# EAGLE design Numberwang_no_artwork (EAGLE 9.4.2)
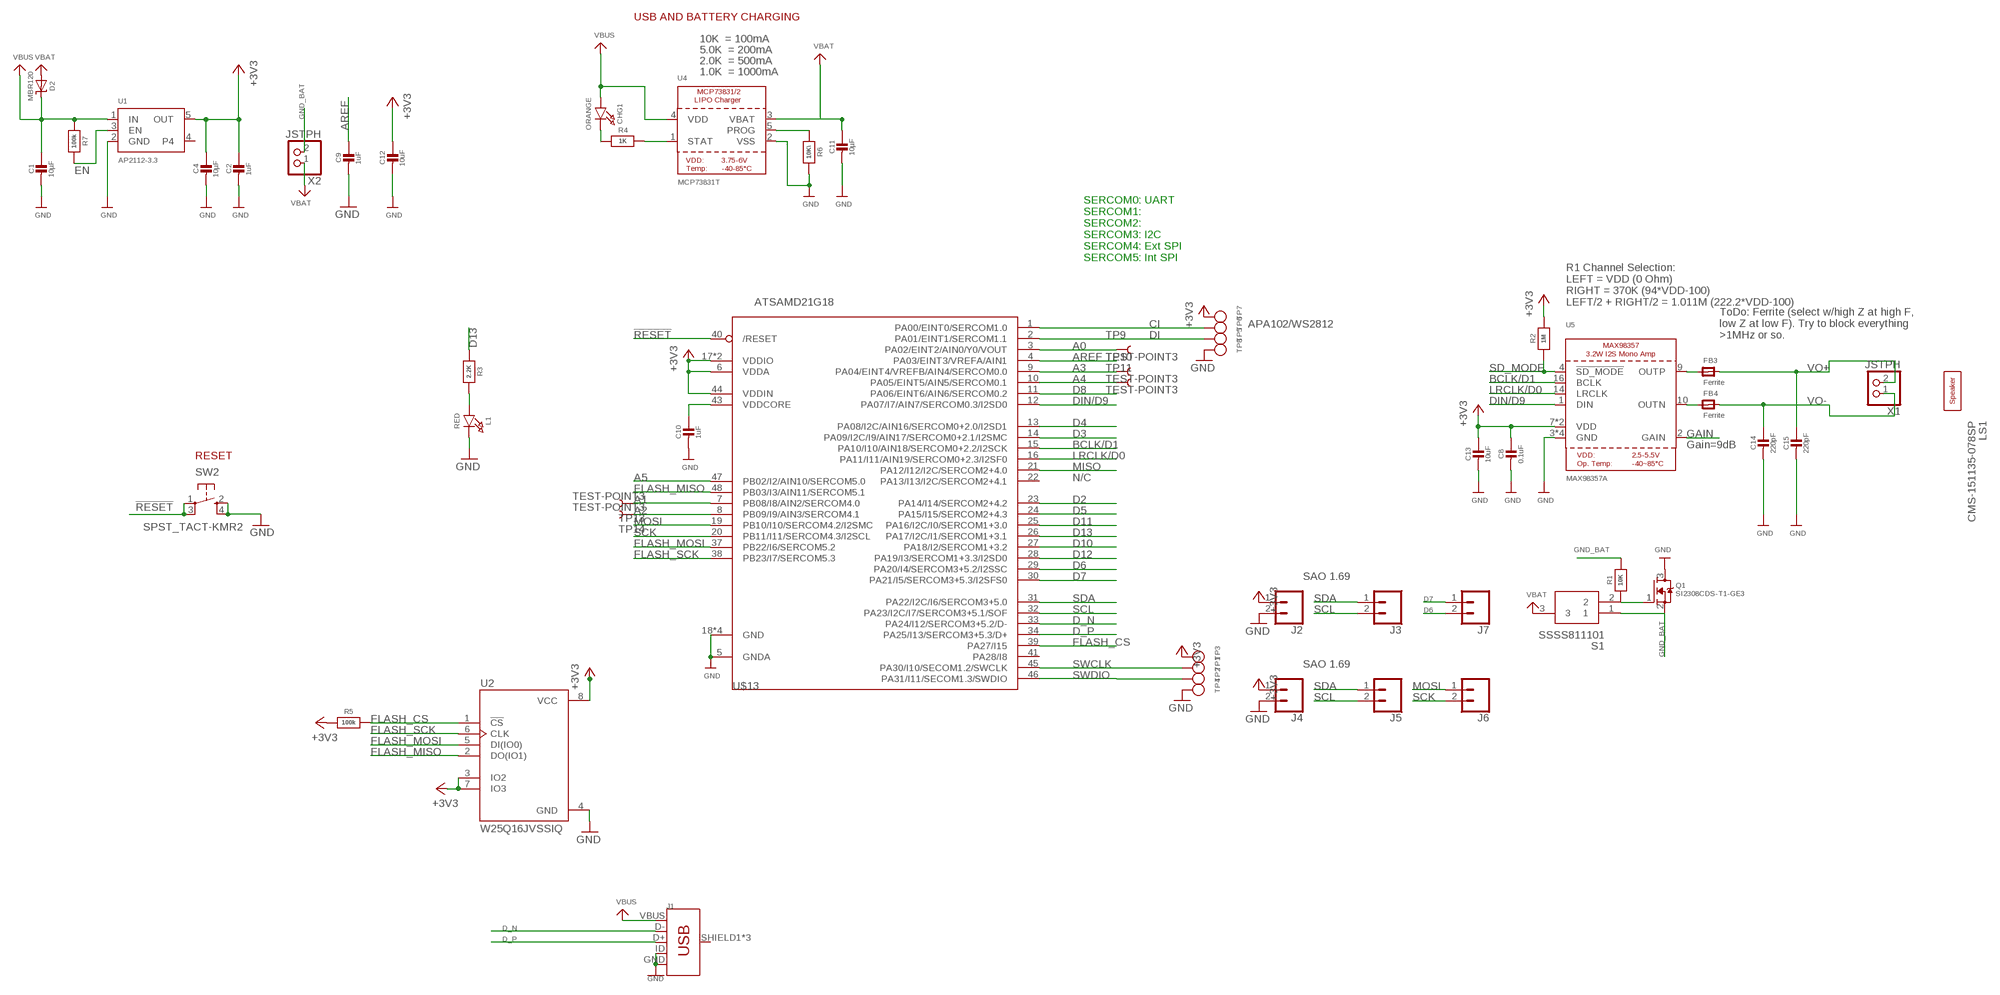
[diagram p0: schematic, sheet 1]

## Parts
C1  10µF  CAP_CERAMIC_0805MP  [_0805MP]
C2  1uF  CAP_CERAMIC_0603MP  [_0603MP]
C4  10µF  CAP_CERAMIC_0805MP  [_0805MP]
C8  0.1uF  CAP_CERAMIC_0805MP  [_0805MP]
C9  1uF  CAP_CERAMIC_0603MP  [_0603MP]
C10  1uF  CAP_CERAMIC_0603MP  [_0603MP]
C11  10µF  CAP_CERAMIC_0805MP  [_0805MP]
C12  10uF  CAP_CERAMIC_0805MP  [_0805MP]
C13  10uF  CAP_CERAMIC_0805MP  [_0805MP]
C14  220pF  CAP_CERAMIC_0805MP  [_0805MP]
C15  220pF  CAP_CERAMIC_0805MP  [_0805MP]
CHG1  ORANGE  LED0805_NOOUTLINE  [CHIPLED_0805_NOOUTLINE]
D2  MBR120  DIODE-SCHOTTKYSOD-123  [SOD-123]
FB3  Ferrite  FERRITE  [0603]
FB4  Ferrite  FERRITE  [0603]
J1  USB_MICRO-B_FEMALE-SMT  [USB-B-MICRO-SMD]
J2  CONN_02  [1X02]
J3  CONN_02  [1X02]
J4  CONN_02  [1X02]
J5  CONN_02  [1X02]
J6  CONN_02  [1X02]
J7  CONN_02  [1X02]
L1  RED  LED0805_NOOUTLINE  [CHIPLED_0805_NOOUTLINE]
LS1  CMS-151135-078SP  [CMS151135078SP]
Q1  SI2308CDS-T1-GE3  MOSFET-NWIDE  [SOT23-WIDE]
R1  10K  RESISTOR_0805MP  [_0805MP]
R2  1M  RESISTOR_0805MP  [_0805MP]
R3  2.2K  RESISTOR_0603MP  [_0603MP]
R4  1K  RESISTOR_0603MP  [_0603MP]
R5  100k  RESISTOR_0603MP  [_0603MP]
R6  10K\  RESISTOR_0603MP  [_0603MP]
R7  100k  RESISTOR_0603MP  [_0603MP]
S1  SSSS811101  [SSSS811101]
SW2  SPST_TACT-KMR2  [KMR2]
TP1  TESTPOINTROUND2MM  [TESTPOINT_ROUND_2MM]
TP2  TESTPOINTROUND2MM  [TESTPOINT_ROUND_2MM]
TP3  TESTPOINTROUND2MM  [TESTPOINT_ROUND_2MM]
TP4  TESTPOINTROUND2MM  [TESTPOINT_ROUND_2MM]
TP5  TESTPOINTROUND2MM  [TESTPOINT_ROUND_2MM]
TP6  TESTPOINTROUND2MM  [TESTPOINT_ROUND_2MM]
TP7  TESTPOINTROUND2MM  [TESTPOINT_ROUND_2MM]
TP8  TESTPOINTROUND2MM  [TESTPOINT_ROUND_2MM]
TP9  TEST-POINT3  [PAD.03X.03]
TP10  TEST-POINT3  [PAD.03X.03]
TP11  TEST-POINT3  [PAD.03X.03]
TP13  TEST-POINT3  [PAD.03X.03]
TP14  TEST-POINT3  [PAD.03X.03]
U1  AP2112-3.3  VREG_SOT23-5  [SOT23-5]
U2  W25Q16JVSSIQ  [SOIC127P790X216-8N]
U4  MCP73831T  MCP73831/2  [SOT23-5@1]
U5  MAX98357A  AUDIOAMP_MAX98357  [QFN16_3MM]
U$13  ATSAMD21G18  ATSAMD21G_QFN  [TQFN48_7MM]
X1  JSTPH  CON_JST_PH_2PIN  [JSTPH2]
X2  JSTPH  CON_JST_PH_2PIN  [JSTPH2]

## Nets
!RESET: SW2.1(P) SW2.3(P1) U$13.40(/RESET)
+3V3: C2.1 C4.1 C8.1 C12.1 C13.1 J2.1 J4.1 R2.2 R5.1 TP3.P$1 TP7.P$1 U1.5(OUT) U2.3(IO2) U2.7(IO3) U2.8(VCC) U5.7(VDD) U5.8(VDD) U$13.6(VDDA) U$13.17(VDDIO) U$13.36(VDDIO) U$13.44(VDDIN)
A0: TP9.P$1 U$13.3(PA02/EINT2/AIN0/Y0/VOUT)
A1: TP13.P$1 U$13.7(PB08/I8/AIN2/SERCOM4.0)
A2: TP14.P$1 U$13.8(PB09/I9/AIN3/SERCOM4.1)
A3: TP10.P$1 U$13.9(PA04/EINT4/VREFB/AIN4/SERCOM0.0)
A4: TP11.P$1 U$13.10(PA05/EINT5/AIN5/SERCOM0.1)
A5: U$13.47(PB02/I2/AIN10/SERCOM5.0)
AREF: C9.1 U$13.4(PA03/EINT3/VREFA/AIN1)
BCLK/D1: U5.16(BCLK) U$13.15(PA10/I10/AIN18/SERCOM0+2.2/I2SCK)
CI: TP6.P$1 U$13.1(PA00/EINT0/SERCOM1.0)
D2: U$13.23(PA14/I14/SERCOM2+4.2)
D3: U$13.14(PA09/I2C/I9/AIN17/SERCOM0+2.1/I2SMC)
D4: U$13.13(PA08/I2C/AIN16/SERCOM0+2.0/I2SD1)
D5: U$13.24(PA15/I15/SERCOM2+4.3)
D6: J7.2 U$13.29(PA20/I4/SERCOM3+5.2/I2SSC)
D7: J7.1 U$13.30(PA21/I5/SERCOM3+5.3/I2SFS0)
D8: U$13.11(PA06/EINT6/AIN6/SERCOM0.2)
D10: U$13.27(PA18/I2/SERCOM1+3.2)
D11: U$13.25(PA16/I2C/I0/SERCOM1+3.0)
D12: U$13.28(PA19/I3/SERCOM1+3.3/I2SD0)
D13: R3.1 U$13.26(PA17/I2C/I1/SERCOM1+3.1)
D_N: J1.D- U$13.33(PA24/I12/SERCOM3+5.2/D-)
D_P: J1.D+ U$13.34(PA25/I13/SERCOM3+5.3/D+)
DI: TP5.P$1 U$13.2(PA01/EINT1/SERCOM1.1)
DIN/D9: U5.1(DIN) U$13.12(PA07/I7/AIN7/SERCOM0.3/I2SD0)
EN: R7.2 U1.3(EN)
FLASH_CS: R5.2 U2.1(!CS) U$13.39(PA27/I15)
FLASH_MISO: U2.2(DO(IO1)) U$13.48(PB03/I3/AIN11/SERCOM5.1)
FLASH_MOSI: U2.5(DI(IO0)) U$13.37(PB22/I6/SERCOM5.2)
FLASH_SCK: U2.6(CLK) U$13.38(PB23/I7/SERCOM5.3)
GAIN: U5.2(GAIN)
GND: C1.2 C2.2 C4.2 C8.2 C9.2 C10.2 C11.2 C12.2 C13.2 C14.2 C15.2 J1.GND J1.ID J2.2 J4.2 L1.C Q1.3(D) R6.2 SW2.2(S) SW2.4(S1) TP4.P$1 TP8.P$1 U1.2(GND) U2.4(GND) U4.2(VSS) U5.3(GND) U5.11(GND) U5.15(GND) U5.THERMAL(GND) U$13.5(GNDA) U$13.18(GND) U$13.35(GND) U$13.42(GND) U$13.THERMAL(GND)
GND_BAT: Q1.2(S) R1.2 S1.1 X2.2
LRCLK/D0: U5.14(LRCLK) U$13.16(PA11/I11/AIN19/SERCOM0+2.3/I2SF0)
MISO: U$13.21(PA12/I12/I2C/SERCOM2+4.0)
MOSI: J6.1 U$13.19(PB10/I10/SERCOM4.2/I2SMC)
N$2: FB4.1 U5.10(OUTN)
N$3: L1.A R3.2
N$4: FB3.1 U5.9(OUTP)
N$5: Q1.1(G) R1.1 S1.2
N$8: CHG1.C R4.1
N$9: R4.2 U4.1(STAT)
N$10: R6.1 U4.5(PROG)
SCK: J6.2 U$13.20(PB11/I11/SERCOM4.3/I2SCL)
SCL: J3.2 J5.2 U$13.32(PA23/I2C/I7/SERCOM3+5.1/SOF)
SD_MODE: R2.1 U5.4(!SD_MODE)
SDA: J3.1 J5.1 U$13.31(PA22/I2C/I6/SERCOM3+5.0)
SWCLK: TP1.P$1 U$13.45(PA30/I10/SECOM1.2/SWCLK)
SWDIO: TP2.P$1 U$13.46(PA31/I11/SECOM1.3/SWDIO)
VBAT: C11.1 D2.A S1.3 U4.3(VBAT) X2.1
VBUS: C1.1 CHG1.A D2.C J1.VBUS R7.1 U1.1(IN) U4.4(VDD)
VDDCORE1: C10.1 U$13.43(VDDCORE)
VO+: C15.1 FB3.2 X1.2
VO-: C14.1 FB4.2 X1.1
Unconnected: J1.SHIELD1(SHIELD) J1.SHIELD2(SHIELD) J1.SHIELD3(SHIELD) U1.4 U$13.22(PA13/I13/I2C/SERCOM2+4.1) U$13.41(PA28/I8)

## Notes on the sheet
- USB AND BATTERY CHARGING
- 10K  = 100mA
- 5.0K  = 200mA
- 2.0K  = 500mA
- 1.0K  = 1000mA
- SERCOM0: UART
  SERCOM1:
  SERCOM2:
  SERCOM3: I2C
  SERCOM4: Ext SPI
  SERCOM5: Int SPI
- R1 Channel Selection:
  LEFT = VDD (0 Ohm)
  RIGHT = 370K (94*VDD-100)
  LEFT/2 + RIGHT/2 = 1.011M (222.2*VDD-100)
- APA102/WS2812
- ToDo: Ferrite (select w/high Z at high F,
  low Z at low F). Try to block everything
  >1MHz or so.
- Gain=9dB
- RESET
- N/C
- SAO 1.69
- SAO 1.69

## Library data of the parts
C1 C2 C4 C8-C15 = microbuilder:CAP_CERAMIC: Ceramic Capacitors 0402 - 0402 Surface Mount Capacitors 16pF 50V 5% [Digikey: 445-4899-2-ND] 18pF 50V 5% [Digikey: 490-1281-2-ND] 22pF 50V 5% [Digikey: 490-1283-2-ND] 68pF 50V 5% [Digikey: 490-1289-2-ND] 0.1uF 10V 10% [Digikey: 490-1318-2-ND] 1.0uF 6.3V 10% [Digikey: 490-1320-2-ND] 0603 - 0603 Surface Mount Capacitors 16 pF 50V 5% [Digikey: 445-5051-2-ND] 22 pF 50V [Digikey: PCC220ACVTR-ND] 33 pF 50V 5% [Digikey: 490-1415-1-ND] 56pF 50V 5% [Digikey: 490-1421-1-ND] 220pF 50V 5% [Digikey: 445-1285-1-ND] 680 pF 50V 2200 pF 50V 5% C0G [Digikey: 445-1297-1-ND] 5600 pF 100V 5% X7R [Digikey: 478-3711-1-ND] 0.1 µF 25V 10% [Digikey: PCC2277TR-ND] 0.22 µF 16V 10% X7R [Digikey: 445-1318-1-ND] 1.0 µF 25V 10% [Digikey: 445-5146-2-ND] 0603 - RF Specific 3pF 250V +/-0.1pF RF [Digikey: 712-1347-1-ND] 18 pF 250V 5% [Digikey: 478-3505-1-ND or 712-1322-1-ND] 56 pF 250V 5% C0G RF [Digikey: 490-4867-1-ND] 68 pF 250V RF [Digikey: 490-4868-1-ND] 0805 - 0805 Surface Mount Capacitors 220 pF 250V 2% RF Ceramic Capacitor [Digikey: 712-1398-1-ND] 1000 pF 50V 2% NP0 Ceramic Capacitor [Digikey: 478-3760-1-ND] 0.1 µF 25V 10% Ceramic Capacitor [Digikey: PCC1828TR-ND] 1.0 µF 16V 10% Ceramic Capacitor[Digikey: 490-1691-2-ND] 10.0 µF 10V 10% Ceramic Capacitor[Digikey: 709-1228-1-ND] 10.0 uF 16V 10% Ceramic Capacitor [Digikey: 478-5165-2-ND] 47 uF 6.3V 20% Ceramic Capacitor [Digikey: 587-1779-1-ND or 399-5506-1-ND] 1206 - 1206 Surface Mount Capacitors 47uF 10V 20% Ceramic Capacitor [Digikey: 490-5528-1-ND or 399-5508-1-ND or 445-6010-1-ND] 100uF 6.3V -20%, +80% Y5V Ceramic Capacitor (Digikey: 490-4512-1-ND, Mouser: 81-GRM31CF50J107ZE1L)
CHG1 L1 = microbuilder:LED: LED 0603 - 0603 Surface Mount Package 2mA: Green LED - Low Power (3.9mcd, 2ma, 1.7Vf) - Digikey: 475-2709-2-ND Orange LED - Low Power (9.8mcd, 2ma, 1.8Vf) - Digikey: 475-1194-2-ND Red LED - Low Power (5mcd, 2ma, 1.8Vf) - Digikey: 475-1195-2-ND Yellow LED - Low Power (7mcd, 2ma, 1.8Vf) - Digikey: 475-1196-2-ND 5mA: Blue LED - Low Power (17mcd, 5ma, 2.9Vf) - Digikey: LNJ937W8CRACT-ND 0805 - 0805 Surface Mount Package 2mA: Red LED (8.8mcd, 2mA, 1.8Vf, Clear) - Low Power [Digikey: 475-2510-1-ND] Green LED (5mcd, 2mA, 1.8Vf, Clear) - Low Power [Digikey: 475-2730-1-ND] Yellow LED (11.3mcd, 2mA, 1.8Vf, Clear) - Low Power [Digikey: 475-2555-1-ND] 20mA: Red LED (104mcd, 20mA, Diffused) - LS R976 [Digikey: 475-1278-6-ND] Red LED (12mcd, 20mA, 2.0Vf, Clear) - APT2012EC [Digikey: 754-1128-1-ND] Green LED (15mcd, 20mA, 2.2Vf, Clear) - APT2012GC [Digikey: 754-1131-1-ND] Orange LED (160mcd, 20mA, 2.1Vf, Clear) - APT2012SECK [Digikey: 754-1130-1-ND] 1206 - 1206 Surface Mount Package Green LED (26mcd, 20mA, Diffused) - LG N971 [Digikey: 475-1407-6-ND] Red LED (15mcd, 20mA, Diffused) - LH N974 [Digikey: 475-1416-6-ND]
D2 = microbuilder:DIODE-SCHOTTKY
FB3 FB4 = microbuilder:FERRITE: Ferrite Bead 0603 MMZ1608B121C - 120 Ohm @ 100MHz, 600mA, 0.15 Ohm DC Resistance - Digikey: 445-2164-1-ND BK1608HW121-T - 120 Ohm, 600mA Ferrite Chip - Digikey: 587-1876-2-ND 0805 HZ0805B272R-10 - 2.7K Ohm @ 100MHz, 200mA, 0.8 Ohm DC Resistance - Digikey: 240-2504-1-ND (see also Murata BLM21BD272SN1L) MMZ2012Y152B - 1.5K Ohm @ 100MHz, 500mA, 0.4 Ohm DC Resistance - Digikey: 445-1560-1-ND - Mainly for high frequency (80-400MHz) MMZ2012R102A - 1K Ohm @ 100MHz, 500mA, 0.3 Ohm DC Resistance - Digikey: 445-1555-2-ND - More general purpose (10-200MHz)
J1 = SparkFun-Connectors:USB_MICRO-B: USB Type Micro-B Connector Male/female and PTH/SMT variants SparkFun Products: SparkFun microB USB Breakout <https://www.sparkfun.com/products/12035> SparkFun USB microB Plug Breakout <https://www.sparkfun.com/products/10031> SparkFun ESP8266 Thing <https://www.sparkfun.com/products/13231>; PROD_ID: CONN-11752
J2-J7 = SparkFun-Connectors:CONN_02: Multi connection point. Often used as Generic Header-pin footprint for 0.1 inch spaced/style header connections On any of the 0.1 inch spaced packages, you can populate with these: Break Away Headers - Straight <https://www.sparkfun.com/products/116> (PRT-00116) Break Away Male Headers - Right Angle <https://www.sparkfun.com/products/553> (PRT-00553) Female Headers <https://www.sparkfun.com/products/115> (PRT-00115) Break Away Headers - Machine Pin <https://www.sparkfun.com/products/117> (PRT-00117) Break Away Female Headers - Swiss Machine Pin <https://www.sparkfun.com/products/743> (PRT-00743) For SCREWTERMINALS and SPRING TERMINALS visit here: Screw Terimnals on SparkFun.com <https://www.sparkfun.com/search/results?term=Screw+Terminals> (5mm/3.5mm/2.54mm spacing) This device is also useful as a general connection point to wire up your design to another part of your project. Our various solder wires solder well into these plated through hole pads. Hook-Up Wire - Assortment (Stranded, 22 AWG) <https://www.sparkfun.com/products/11375> (PRT-11375) Hook-Up Wire - Assortment (Solid Core, 22 AWG) <https://www.sparkfun.com/products/11367> (PRT-11367) View the entire wire category on our website here <https://www.sparkfun.com/categories/141> Special notes: Molex polarized connector foot print use with: PRT-08233 with associated crimp pins and housings. 2.54_SCREWTERM for use with PRT-10571. 3.5mm Screw Terminal footprints for PRT-08084 5mm Screw Terminal footprints for use with PRT-08432
LS1 = SamacSys_Parts:CMS-151135-078SP: Speakers & Transducers 0.7W 8ohm 550Hz 15x11mm Solder Pads Source: Datasheet <https://componentsearchengine.com/Datasheets/1/CMS-151135-078SP.pdf>; DESCRIPTION: Speakers & Transducers 0.7W 8ohm 550Hz 15x11mm Solder Pads; HEIGHT: 3.7mm; MANUFACTURER_NAME: CUI; MANUFACTURER_PART_NUMBER: CMS-151135-078SP; MOUSER_PART_NUMBER: 490-CMS-151135-078SP; MOUSER_PRICE-STOCK: https://www.mouser.com/Search/Refine.aspx?Keyword=490-CMS-151135-078SP
Q1 = microbuilder:MOSFET-N: N-Channel Mosfet LEGEND VDS: Voltage Drain-Source ID: Drain Current RDS(ON): Drain-Source On-State Resistance VGS(TH): Gate-Source Threshold Voltage CISS: Drain-Source Input Capacitance SOT-23 Name VDS ID RDS(ON) VGS(TH) CISS Order Number 2N7002E 60V 260mA 2.5 Ohm 2.5V @ 250uA 26.7pF @ 25V 2N7002ET1GOSTR-ND BSH103 30V 850mA 400 mOhm 400mV @ 1mA 83pF @ 24V BSH103,235-ND BSS138 60V 320mA 1.6 Ohm 1.5V @ 250uA 50pF @ 10V Mouser: 771-BSS138PW115 DMN2075U-7 20V 4.2A 38 mOhm 1V @ 250 uA 594.3pF @ 10V DMN2075U-7DICT-ND * BSS138 good choice for I2C level-shifting
R1-R7 = microbuilder:RESISTOR: Resistors 0402 - 0402 Surface Mount Package 22 Ohm 1% 1/16W [Digikey: 311-22.0LRTR-ND] 33 Ohm 5% 1/16W 1.0K 5% 1/16W 1.5K 5% 1/16W 2.0K 1% 1/16W 10.0K 1% 1/16W [Digikey: 311-10.0KLRTR-ND] 10.0K 5% 1/16W [Digikey: RMCF0402JT10K0TR-ND] 12.1K 1% 1/16W [Digikey: 311-22.0LRTR-ND] 100.0K 5% 1/16W 0603 - 0603 Surface Mount Package 0 Ohm 1/10 Watt 1% Resistor 15 Ohm 1/10 Watt 1% Resistor 33 Ohm 1/10 Watt 1% Resistor 49.9 Ohm 1/10 Watt 1% Resistor 100 Ohm 1/10 Watt 1% Resistor 150 Ohm 1/10 Watt 1% Resistor 240 Ohm 1/10 Watt 1% Resistor 390 Ohm 1/10 Watt 1% Resistor 560 Ohm 1/10 Watt 1% Resistor 680 Ohm 1/10 Watt 1% Resistor 750 Ohm 1/10 Watt 1% Resistor 1.0K Ohm 1/10 Watt 1% Resistor 1.5K Ohm 1/10 Watt 1% Resistor 2.0K Ohm 1/10 Watt 1% Resistor 2.2K Ohm 1/10 Watt 1% Resistor 3.3K Ohm 1/10 Watt 1% Resistor 4.7K Ohm 1/10 Watt 1% Resistor 10.0K Ohm 1/10 Watt 1% Resistor 12.0K Ohm 1/10 Watt 1% Resistor 12.1K Ohm 1/10 Watt 1% Resistor 20.0K Ohm 1/10 Watt 1% Resistor 33.0K Ohm 1/10 Watt 1% Resistor 100.0K Ohm 1/10 Watt 1% Resistor 0805 - 0805 Surface Mount Package 0 Ohm 1/8 Watt 1% Resistor 33 Ohm 1/8 Watt 1% Resistor 100 Ohm 1/8 Watt 1% Resistor 150 Ohm 1/8 Watt 1% Resistor 200 Ohm 1/8 Watt 1% Resistor 240 Ohm 1/8 Watt 1% Resistor 330 Ohm 1/8 Watt 1% Resistor 390 Ohm 1/8 Watt 1% Resistor 470 Ohm 1/8 Watt 1% Resistor 1.0K Ohm 1/8 Watt 1% Resistor 1.5K Ohm 1/8 Watt 1% Resistor 2.0K Ohm 1/8 Watt 1% Resistor 4.7K Ohm 1/8 Watt 1% Resistor 5.1K Ohm 1/8 Watt 1% Resistor 5.6K Ohm 1/8 Watt 1% Resistor 10.0K Ohm 1/8 Watt 1% Resistor 22.0K Ohm 1/8 Watt 1% Resistor 33.0K Ohm 1/8 Watt 1% Resistor 100K Ohm 1/8 Watt 1% Resistor 1206 - 1206 Surface Mount Package 2012 - 2010 Surface Mount Package 0.11 Ohm 1/2 Watt 1% Resistor - Digikey: RHM.11UCT-ND
S1 = SamacSys_Parts:SSSS811101: Slide Switches SPDT HORZ GRND 1.5mm Source: Datasheet <http://docs-emea.rs-online.com/webdocs/152d/0900766b8152d5b8.pdf>; DESCRIPTION: Slide Switches SPDT HORZ GRND 1.5mm; HEIGHT: mm; MANUFACTURER_NAME: ALPS; MANUFACTURER_PART_NUMBER: SSSS811101; MOUSER_PART_NUMBER: 688-SSSS811101; MOUSER_PRICE-STOCK: https://www.mouser.com/Search/Refine.aspx?Keyword=688-SSSS811101; RS_PART_NUMBER: 1238939; RS_PRICE-STOCK: http://uk.rs-online.com/web/p/products/1238939
SW2 = Adafruit:SPST_TACT: SMT 6mm switch, EVQQ2 series http://www.ladyada.net/library/eagle
TP1-TP8 = microbuilder:TESTPOINT: Test Point Various test points for characterisation and PCB testing TESTPOINT_SMT - Compact Surface Mount Test Point [Digikey: 5016KTR-ND]
TP9-TP11 TP13 TP14 = SparkFun-Connectors:TEST-POINT: SparkFun Test Points Bare copper test points for troubleshooting or In-Circuit-Testing. These are used by our Production team for verifying production board runs using pogo-pins on test beds. SparkFun Products: SparkFun LSM9DS1 Breakout <https://www.sparkfun.com/products/13284> SparkFun PSOC <https://www.sparkfun.com/products/13714> SparkFun Load Cell Amplifier <https://www.sparkfun.com/products/13879>
U1 = microbuilder:VREG_SOT23-5: SOT23-5 Fixed Voltage Regulators To better organise some of the SOT23-5 fixed voltage regulators in this library, this new part was created. Part Current Out V Out V In V Dropout Digikey Part No. ADP121 150mA 3.3V 3.4-5.5V 0.09V @ 150mA ADP121-AUJZ33R7CT-ND ADP121 150mA 3.0V 3.1-5.5V 0.09V @ 150mA ADP121-AUJZ30R7CT-ND ADP122 300mA 3.3V 3.4-5.5V 0.085V @ 300mA ADP122AUJZ-3.3-R7CT-ND ADP1712 300mA 3.3V 3.5-5.5V 0.17V @ 300mA ADP1712AUJZ-3.3-R7TR-ND AP7311 (Low Cost) 150mA 3.3V 3.5-6V 0.15V @ 150mA AP7311-33WG-7DICT-ND LD39015M18R 150mA 1.8V 1.9V-5.5V 0.08V @ 100mA 497-6977-1-ND MCP1824T-3302E/OT 300mA 3.3V 3.5V-6V 0.2V @ 300mA MCP1824T-3302E/OTCT-ND MIC5205-2.5YM5 TR 150mA 2.5V 2.7-16V 0.165V @ 150mA 576-1257-2-ND MIC5205-3.0YM5 TR 150mA 3.0V 3.2V-16V 0.165V @ 150mA 576-1258-2-ND MIC5205-3.3YM5 TR 150mA 3.3V 3.5V-16V 0.165V @ 150mA 576-1259-2-ND TPS780330220 150mA 3.3V+2.2V 3.6-5.5V 250mV Max 296-23332-1-ND TDA3663/N1,135 100mA 3.3V 3.5-45V 0.18V @ 50mA 568-5343-1-ND
U2 = W25Q16JVSSIQ:W25Q16JVSSIQ: 3v 16m-Bit Serial Flash Memory With Dual; AVAILABILITY: Unavailable; DESCRIPTION: 3v 16m-Bit Serial Flash Memory With Dual; MF: Winbond Electronics; MP: W25Q16JVSSIQ; PACKAGE: SOIC-8 Winbond; PRICE: None
U4 = microbuilder:MCP73831/2: MCP73831/2 LIPO Charger VDD: 3.75 - 6V Temp -40 - 85°C Programmable Charge Rate: 15-500mA NOTE: STAT is a tri-state logic output on the MCP73831 and an open-drain output on the MCP73832. SOT23-5 with 4.2V output and tri-state logic on STAT = MCP73831T-2ACI/OT
U5 = microbuilder:AUDIOAMP_MAX98357: MAX98357 - 3.2W I2S Mono Audio Amp
U$13 = microbuilder:ATSAMD21G
X1 X2 = microbuilder:CON_JST_PH_2PIN: JST 2-Pin Right-Angle Connector PH-Series - 4UConnector: 17311 SH-Series - 4UConnector: 07278

## Board
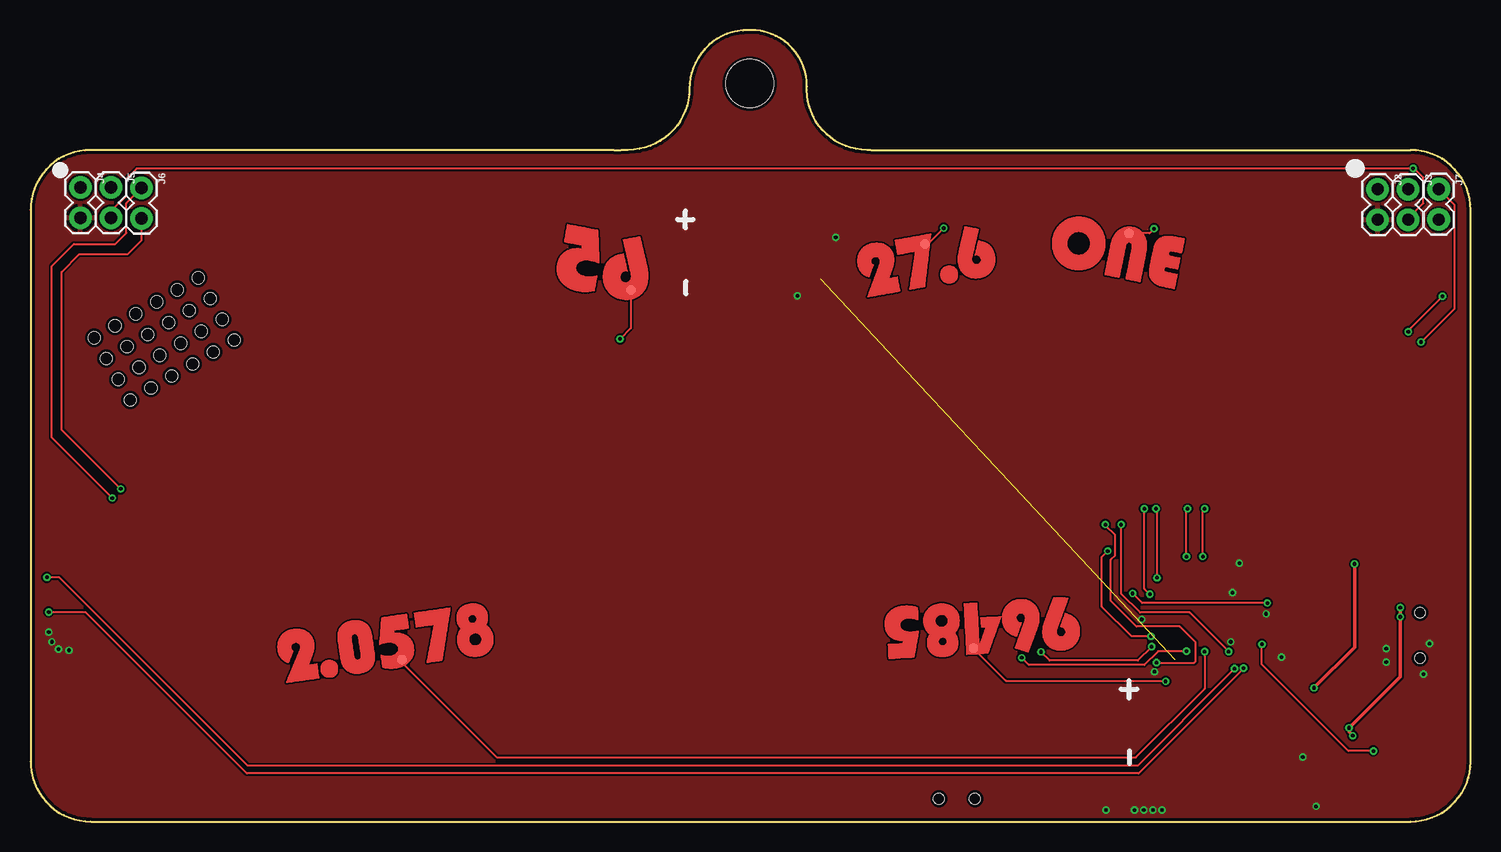
[diagram p1: board, top side]
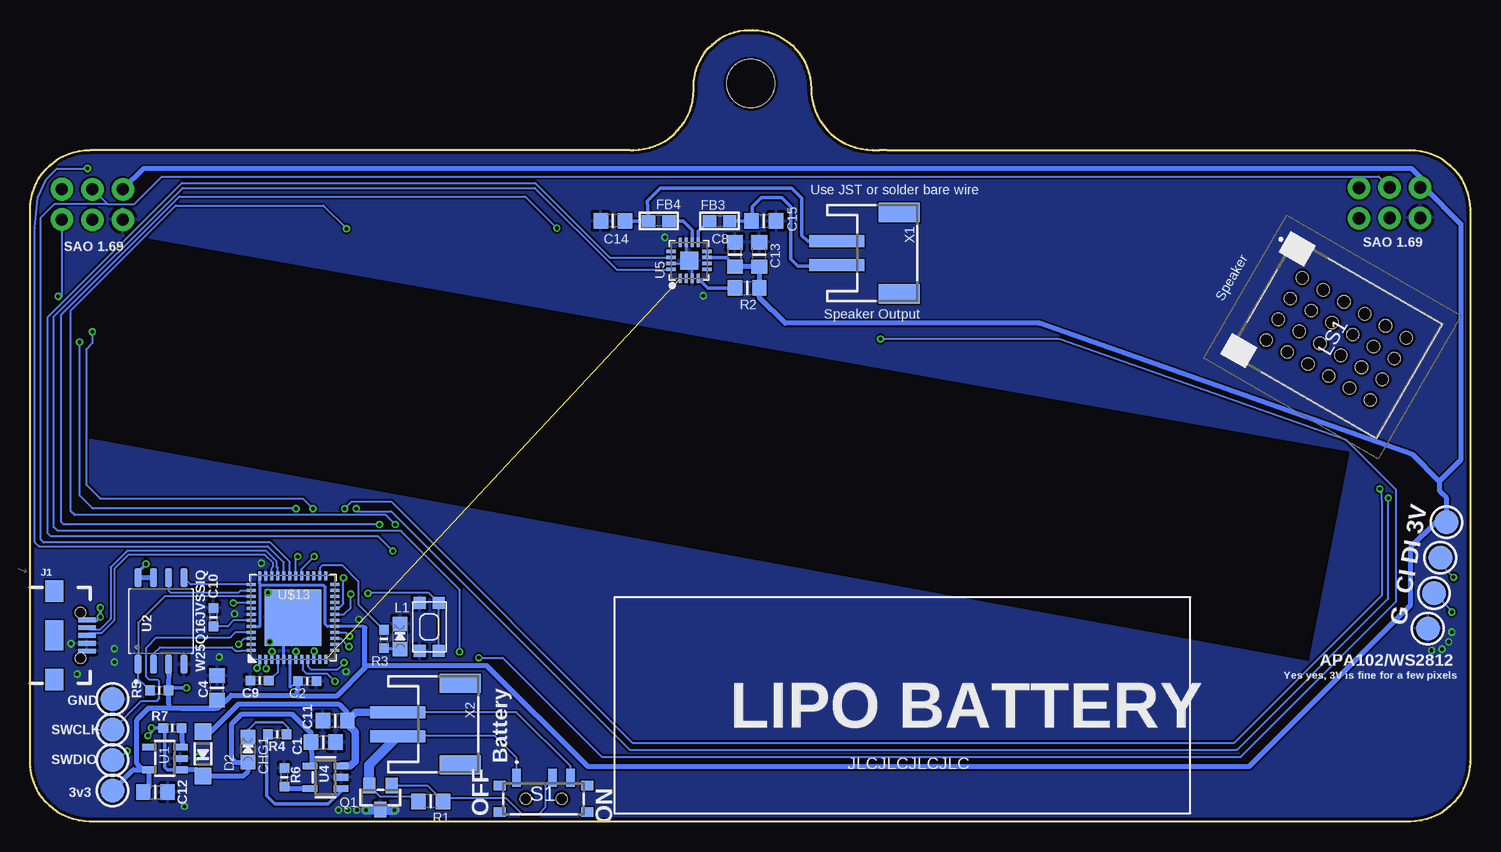
[diagram p2: board, bottom side, seen from below]

Size 120 x 66 mm. Coordinates in mm from the lower left corner, seen from the top.
Outline: 0,51 0,5 arc90 5,0 115,0 arc90 120,5 120,51 arc90 115,56 70,56 69.7,56 arc-90 64.7,61 64.7,61.3 arc90 60,66 59.8,66 arc90 54.9,61.1 arc-90 49.8,56 49.2,56 48.6,56 5,56 arc90 0,51
Copper layers (1*16): Top 0.035mm / dielectric 1.5mm / Bottom 0.035mm
Design rules "SeeedStudio_2layer_DRU_no_angle_20140221 *": minimum track width 6mil, minimum drill 0.3mm, track to track 6mil, track to pad 6mil, pad to pad 6mil, via to via 6mil, smd to smd 0mil, copper to edge 10mil, drill to drill 10mil, minimum pad ring 10mil, minimum via ring 6mil, stop-mask expansion 2mil, vias tented up to drill 100mil, thermal gap 10mil
Holes 4 mm at 59.93,61.54
Holes 1 mm at 13.97,45.33 12.23,44.33 10.5,43.33 8.77,42.33 7.04,41.33 5.31,40.33 6.31,38.6 8.04,39.6 9.77,40.6 11.5,41.6 13.23,42.6 14.97,43.6 15.97,41.87 14.23,40.87 12.5,39.87 10.77,38.87 9.04,37.87 7.31,36.87 16.97,40.14 15.23,39.14 13.5,38.14 11.77,37.14 10.04,36.14 8.31,35.14 13.97,45.33 12.23,44.33 10.5,43.33 8.77,42.33 7.04,41.33 5.31,40.33 6.31,38.6 8.04,39.6 9.77,40.6 11.5,41.6 13.23,42.6 14.97,43.6 15.97,41.87 14.23,40.87 12.5,39.87 10.77,38.87 9.04,37.87 7.31,36.87 16.97,40.14 15.23,39.14 13.5,38.14 11.77,37.14 10.04,36.14 8.31,35.14
bRestrict: area 10.1,13.5 to 115.2,48.5; area 10.2,13.5 to 115.3,48.6
Milling: 52 lines

### Footprints (pad centres in the part's own frame; a part is rotated, then mirrored left to right if it is on the bottom)
_0805MP = smd 1.2 x 1.3: 1 -1.016,0; 2 1.016,0
_0603MP = smd 0.8 x 0.8: 1 -0.762,0; 2 0.762,0
CHIPLED_0805_NOOUTLINE = smd 1.2 x 1.2: A 0,-1.05; C 0,1.05
SOD-123 = smd 1.4 x 1.4: A 1.85,0; C -1.85,0
0603 = smd 1.1 x 1: 1 -0.85,0; 2 0.85,0
USB-B-MICRO-SMD = smd 1.45 x 0.4: D+ 2.725,0; D- 2.725,0.65; GND 2.725,-1.3; ID 2.725,-0.65; VBUS 2.725,1.3 | smd 1.5 x 1.8: SHIELD1 0,3.685; SHIELD2 0,-3.685 | smd 1.5 x 2.5: SHIELD3 0,0 | hole 0.85: 2.2,1.9; 2.2,-1.9
1X02 = drill 1.016 pad 1.88: 1 0,0; 2 2.54,0
SOT23-WIDE = smd 1 x 1.27: 1 -0.95,-1; 2 0.95,-1; 3 0,1
SSSS811101 = smd 0.7 x 1.5: 1 -2.25,1.75; 2 0.75,1.75; 3 2.25,1.75 | smd 1 x 0.8: 4 -3.65,1.1; 5 -3.65,-1.1; 6 3.65,1.1; 7 3.65,-1.1 | hole 0.9: -1.5,0; 1.5,0
KMR2 = smd 1 x 1: 1 2,0.8; 2 2,-0.8; 3 -2,0.8; 4 -2,-0.8
TESTPOINT_ROUND_2MM = smd 2 x 2: P$1 0,0
PAD.03X.03 = smd 0.762 x 0.762: P$1 0,0
SOT23-5 = smd 0.55 x 1.2: 1 -0.95,-1.3; 2 0,-1.3; 3 0.95,-1.3; 4 0.95,1.3; 5 -0.95,1.3
SOIC127P790X216-8N = smd 1.61 x 0.58: 1 -3.605,1.905; 2 -3.605,0.635; 3 -3.605,-0.635; 4 -3.605,-1.905; 5 3.605,-1.905; 6 3.605,-0.635; 7 3.605,0.635; 8 3.605,1.905
SOT23-5@1 = smd 0.55 x 1.2: 1 -0.95,-1.3; 2 0,-1.3; 3 0.95,-1.3; 4 0.95,1.3; 5 -0.95,1.3
QFN16_3MM = smd 0.8 x 0.28: 1 -1.5,0.75; 2 -1.5,0.25; 3 -1.5,-0.25; 4 -1.5,-0.75; 9 1.5,-0.75; 10 1.5,-0.25; 11 1.5,0.25; 12 1.5,0.75 | smd 0.28 x 0.8: 5 -0.75,-1.5; 6 -0.25,-1.5; 7 0.25,-1.5; 8 0.75,-1.5; 13 0.75,1.5; 14 0.25,1.5; 15 -0.25,1.5; 16 -0.75,1.5 | smd 1.5 x 1.5: THERMAL 0,0
TQFN48_7MM = smd 0.25 x 0.75: 1 -2.75,-3.475; 2 -2.25,-3.475; 3 -1.75,-3.475; 4 -1.25,-3.475; 5 -0.75,-3.475; 6 -0.25,-3.475; 7 0.25,-3.475; 8 0.75,-3.475; 9 1.25,-3.475; 10 1.75,-3.475; 11 2.25,-3.475; 12 2.75,-3.475; 25 2.75,3.475; 26 2.25,3.475; 27 1.75,3.475; 28 1.25,3.475; 29 0.75,3.475; 30 0.25,3.475; 31 -0.25,3.475; 32 -0.75,3.475; 33 -1.25,3.475; 34 -1.75,3.475; 35 -2.25,3.475; 36 -2.75,3.475 | smd 0.75 x 0.25: 13 3.475,-2.75; 14 3.475,-2.25; 15 3.475,-1.75; 16 3.475,-1.25; 17 3.475,-0.75; 18 3.475,-0.25; 19 3.475,0.25; 20 3.475,0.75; 21 3.475,1.25; 22 3.475,1.75; 23 3.475,2.25; 24 3.475,2.75; 37 -3.475,2.75; 38 -3.475,2.25; 39 -3.475,1.75; 40 -3.475,1.25; 41 -3.475,0.75; 42 -3.475,0.25; 43 -3.475,-0.25; 44 -3.475,-0.75; 45 -3.475,-1.25; 46 -3.475,-1.75; 47 -3.475,-2.25; 48 -3.475,-2.75 | smd 4.7 x 4.7: THERMAL 0,0
JSTPH2 = smd 1 x 4.6: 1 -1,-3.7; 2 1,-3.7 | smd 1.6 x 3.4: NC1 -3.4,1.5; NC2 3.4,1.5

### Placement (x,y rotation side)
C1  95.55,6.61 0 bottom
C2  96.9,11.7 0 bottom
C4  104.41,11.14 90 bottom
C8  61.26,47.29 90 bottom
C9  100.87,11.76 180 bottom
C10  104.71,17.03 90 bottom
C11  94.58,8.41 180 bottom
C12  109.55,2.45 0 bottom
C13  59.23,47.29 90 bottom
C14  71.42,50.08 180 bottom
C15  58.84,50.08 0 bottom
CHG1  101.83,6.01 0 bottom
D2  105.59,5.65 90 bottom
FB3  62.53,50.08 0 bottom
FB4  67.61,50.08 180 bottom
J1  117.99,15.51 0 bottom
J2  112.26,52.72 270 top
J3  114.8,52.72 270 top
J4  4.16,52.88 270 top
J5  6.7,52.88 270 top
J6  9.25,52.83 270 top
J7  117.35,52.73 270 top
L1  89.15,15.43 0 bottom
LS1  11.2,40.26 240 bottom
Q1  90.8,2 180 bottom
R1  86.61,1.68 180 bottom
R2  60.24,44.49 0 bottom
R3  90.51,15.22 270 bottom
R4  99.4,7.27 180 bottom
R5  109.23,10.94 180 bottom
R6  98.81,3.69 90 bottom
R7  108.13,7.81 0 bottom
S1  77.2,1.9 0 bottom
SW2  86.72,16.23 270 bottom
TP1  113.12,7.66 0 bottom
TP2  113.12,5.12 0 bottom
TP3  113.12,2.58 0 bottom
TP4  113.12,10.2 0 bottom
TP5  2.47,22 350 bottom
TP6  2.99,19.05 350 bottom
TP7  1.95,24.95 350 bottom
TP8  3.51,16.09 350 bottom
TP9  74.52,48.17 0 top
TP10  91.52,49.05 0 top
TP11  50.03,44.32 0 top
TP13  30.96,13.49 0 top
TP14  78.56,14.45 0 top
U1  108.77,5.27 90 bottom
U2  109.08,16.72 90 bottom
U4  95.38,3.69 90 bottom
U5  65.07,46.78 90 bottom
U$13  98.09,17 0 bottom
X1  49.07,47.4 270 bottom
X2  85.65,8.12 270 bottom

### Tracks (layer width: path | path; a pad name or v marks a point on that pad's centre or on a via)
!RESET  (via drill 0.3)
  Top 0.152: v103.07,18.22 92.63,18.22 v91.84,19.02
  Bottom 0.152: v91.84,19.02 91.75,19.1 86.8,19.1 SW2.3 SW2.1 | v103.07,18.22 103.03,18.25 U$13.40
+3V3  (via drill 0.3)
  Top 0.305: v106.95,11.14 110.33,14.52 v110.33,21.48
  Bottom 0.152: C2.1 98.23,11.22 98.34,11.22
  Bottom 0.254: 92.09,16.15 92.14,16.2 92.2,16.25 U$13.17 95.2,16.25 95.39,16.45 95.39,19.55 95.55,19.7 100.73,19.7 100.84,19.82 | U$13.6 98.34,11.22 | 100.84,19.82 U$13.36 | U$13.44 100.88,16.25 100.83,16.3 100.83,19.8 100.84,19.82
  Bottom 0.305: R5.1 108.12,11.14 v106.95,11.14 | v110.33,21.48 110.99,20.82 111.04,20.82 111.04,20.39 U2.8 | C8.1 61.95,47.03 62.22,47.03 62.23,47.03 U5.7 U5.8
  Bottom 0.406: C12.1 110.06,2.88 U1.5 | 108.38,9.44 R5.1 108.38,12.26 108.44,12.33 U2.3 | 92.09,13 92.09,12.79 94.4,10.49 97.75,10.49 97.75,10.54 | 92.09,13 92.09,16.15 | 107.38,9.44 104.49,9.44 104.41,9.52 C4.1 | U1.5 110.59,4.32 111.09,4.82 111.09,8.48 110.13,9.44 108.38,9.44 | 107.38,9.44 104.34,9.44 103.24,10.54 97.75,10.54 | 107.38,9.44 108.38,9.44 | TP3.P$1 111.39,4.32 U1.5 | 92.09,13 81.93,13 73.5,4.56 18.43,4.56 4.97,18.03 4.97,22.85 2.87,24.95 TP7.P$1 1.95,26.97 2.5,27.52 2.5,28.41 2.56,28.36 | 2.56,28.36 0.75,30.16 0.75,49.83 3.8,52.88 J4.1 4.16,53.74 4.87,54.45 110.53,54.45 J2.1 | U2.7 U2.8 | C2.1 97.75,10.69 97.75,10.54 | C8.1 C13.1 R2.2 59.23,43.71 57.07,41.55 35.9,41.55 4.79,30.59 2.56,28.36
A0  (via drill 0.3)
  Top 0.152: v99.84,14.17 96.59,17.42 92.46,17.42 90.88,19 v90.88,24.76 | TP9.P$1 74.79,48.17 v76.1,49.48
  Bottom 0.152: U$13.3 v99.84,14.17 | v90.88,24.76 117.17,24.76 117.4,24.99 117.4,42.27 107.54,52.12 78.74,52.12 v76.1,49.48
A1  (via drill 0.3)
  Top 0.152: v97.84,14.17 97.84,11.07 92.1,5.33 38.86,5.33 30.96,13.23 TP13.P$1
  Bottom 0.152: U$13.7 v97.84,14.17
A2  (via drill 0.3)
  Top 0.152: TP14.P$1 81.28,11.73 94.54,11.73 v94.59,11.68
  Bottom 0.152: v94.59,11.68 95.25,12.34 96.97,12.34 97.29,12.66 97.29,13.48 U$13.8
A3  (via drill 0.3)
  Top 0.152: v93.83,13.25 96.97,13.25 97.08,13.36 97.08,14.94 95.76,16.26 92.15,16.26 90.02,18.39 90.02,21.84 90.37,22.2 90.37,23.88 89.56,24.69 v89.56,24.76 | v93.62,49.43 93.25,49.05 TP10.P$1
  Bottom 0.152: U$13.9 96.84,12.92 96.62,12.7 94.34,12.7 93.83,13.21 v93.83,13.25 | v89.56,24.76 90.35,25.55 116.28,25.55 116.59,25.86 116.59,42.62 107.85,51.36 95.56,51.36 v93.62,49.43
A4  (via drill 0.3)
  Top 0.152: v96.32,14.2 93.95,14.2 92.81,13.06 83.2,13.06 v82.6,13.65 | TP11.P$1 50.03,41.14 v49.12,40.23
  Bottom 0.152: U$13.10 96.34,14.17 v96.32,14.2 | v82.6,13.65 80.61,13.65 76.4,9.45 72.34,5.38 19.1,5.38 6.15,18.34 6.15,27.64 10.31,31.8 12.9,32.72 34.24,40.23 v49.12,40.23
AREF
  Bottom 0.152: U$13.4 99.34,12.44 C9.1
BCLK/D1  (via drill 0.3)
  Top 0.152: v93.42,14.58 92.28,13.44 84.91,13.44 v84.2,14.15
  Bottom 0.152: U$13.15 94.09,15.25 v93.42,14.58 | v84.2,14.15 84.18,14.17 84.18,19.3 89.1,24.23 117.7,24.23 118.02,24.55 118.02,42.1 107.29,52.83 77.93,52.83 71.12,46.03 U5.16
CI  (via drill 0.3)
  Top 0.152: v101.08,12.79 100.85,12.56 100.85,12.52 97.78,9.45 92.34,4.01 18.03,4.01 4.56,17.47 v1.52,17.47
  Bottom 0.152: U$13.1 100.84,13.04 v101.08,12.79 | TP6.P$1 1.47,17.52 v1.52,17.47
D6  (via drill 0.3)
  Top 0.152: v96.32,22.1 96.32,25.98 v96.42,26.08 | v117.65,43.79 114.81,40.95 v114.81,40.84
  Bottom 0.152: U$13.29 97.34,21.07 v96.32,22.1 | J7.2 117.35,43.79 v117.65,43.79 | v114.81,40.84 114.81,39.88 115.32,39.37 115.32,28.09 114.15,26.92 97.26,26.92 v96.42,26.08
D7  (via drill 0.3)
  Top 0.152: v97.69,22.1 97.69,25.93 v97.84,26.08 | v115.88,39.98 118.67,42.77 118.67,51.41 J7.1
  Bottom 0.152: U$13.30 97.84,21.95 v97.69,22.1 | v97.84,26.08 114.78,26.08 115.88,27.18 v115.88,39.98
D13
  Bottom 0.152: U$13.26 95.84,21.14 95.6,21.38 93.99,21.38 92.64,20.03 92.64,18.11 R3.1
D_N
  Bottom 0.152: U$13.33 99.34,21.16 99.44,21.25 99.44,21.69 100.3,22.55 111.93,22.55 112.02,22.46 113.28,21.2 113.28,16.96 113.28,16.91 114.19,15.99 114.96,15.99 115.13,16.16 J1.D-
D_P
  Bottom 0.152: U$13.34 99.84,21.16 99.74,21.25 99.74,21.56 100.42,22.24 111.8,22.24 112.97,21.07 112.97,16.96 112.97,16.78 113.97,15.78 | 113.97,15.78 | 113.97,15.78 114.06,15.69 115.09,15.69 J1.D+
DI  (via drill 0.3)
  Top 0.152: v100.32,12.74 99.76,12.18 92.25,4.67 18.08,4.67 2.38,20.36 v1.36,20.36
  Bottom 0.152: U$13.2 100.34,12.76 v100.32,12.74 | v1.36,20.36 2.47,21.47 TP5.P$1
DIN/D9  (1 unrouted)
EN
  Bottom 0.406: U1.3 107.28,6.4 R7.2
FLASH_CS
  Bottom 0.152: U$13.39 108.79,18.75 110.98,16.56 U2.1 110.98,11.84 R5.2
FLASH_MISO
  Bottom 0.152: U2.2 109.71,13.97 109.16,14.52 103.17,14.52 102.89,14.24 102.39,14.24 102.38,14.25 U$13.48
FLASH_MOSI
  Bottom 0.152: U$13.37 106.59,19.75 U2.5
FLASH_SCK
  Bottom 0.152: U2.6 108.44,19.24 108.3,19.09 102.61,19.09 102.45,19.25 U$13.38
GND  (via drill 0.3)
  Bottom 0.152: U$13.THERMAL 98.25,17 | U5.3 64.82,46.53 U5.THERMAL | U5.15 65.32,46.53 U5.THERMAL | U5.11 65.32,47.03 U5.THERMAL
  Bottom 0.254: U$13.5 98.84,16.41 98.25,17
  Bottom 0.305: U$13.THERMAL 100.02,15.08 v100.02,14.98
  Bottom 0.813: v92,0.96 91.96,1 Q1.3 90.77,0.96 v89.61,0.96
  other vias: 102.96,17.32 104.23,13.71 100.17,19.09 93.67,12.49 100.73,21.53 92.76,0.97 93.52,0.97 94.28,0.97 92.6,16.86 67.1,48.71 63.9,43.83 107.13,1.26 106.01,5.38 116.07,12.29 112.97,14.42 112.97,13.3 116.58,14.83 1.52,15.79 1.77,14.98 2.33,14.37 3.19,14.27
  pour Bottom: -7.86,68.19 129.48,68.19 129.48,-4.27 -7.86,-4.27
  pour Top: -12.13,68.95 130.22,68.95 130.22,-6.64 -12.13,-6.64
GND_BAT
  Bottom 0.152: S1.1 79.45,5.33 81.28,7.16 89.31,7.16 X2.2 | R1.2 88.04,2.08 90.83,2.08 Q1.2
  Bottom 0.813: Q1.2 91.75,4.72 X2.2
LRCLK/D0  (via drill 0.3)
  Top 0.152: v93.37,15.44 91.75,15.44 89.28,17.91 89.28,22.07 v89.76,22.55
  Bottom 0.152: U$13.16 93.68,15.75 v93.37,15.44 | v89.76,22.55 90.98,23.77 118.26,23.77 118.53,24.04 118.53,42.05 107.34,53.24 77.88,53.24 71.67,47.03 U5.14
MOSI  (via drill 0.3)
  Top 0.152: v93.27,18.95 92.81,19.41 v92.81,26.08 | v6.81,26.98 1.78,32 1.78,46.33 3.61,48.16 7.06,48.16 7.98,49.07 7.98,51.56 J6.1
  Bottom 0.152: U$13.19 93.85,17.25 93.27,17.83 v93.27,18.95 | v92.81,26.08 92.58,25.86 89.9,25.86 70.04,5.99 19.41,5.99 6.81,18.59 v6.81,26.98
N$2
  Bottom 0.305: U5.10 64.82,49.32 65.58,50.08 FB4.1
N$3
  Bottom 0.305: L1.A 89.17,14.37 R3.2
N$4
  Bottom 0.305: U5.9 64.32,49.24 FB3.1
N$5
  Bottom 0.152: S1.2 77.06,3.04 77.06,1.17 77.62,0.61 78.99,0.61 80.31,1.93 85.65,1.93 | Q1.1 86.87,3 85.8,1.93 85.65,1.93 | R1.1 85.65,1.73 85.65,1.93
N$8
  Bottom 0.203: CHG1.C 101.83,7.63 101.19,8.27 98.95,8.27 98.49,7.81 98.49,7.32
  Bottom 0.406: 98.49,7.32 R4.1
N$9
  Bottom 0.305: R4.2 100.27,7.24 100.27,2.13 99.61,1.47 95.14,1.47 94.08,2.53 U4.1
N$10
  Bottom 0.406: U4.5 98.71,2.74 R6.1
SCK  (via drill 0.3)
  Top 0.152: v93.88,20.32 93.88,25.98 v93.78,26.08 | v7.52,27.74 2.59,32.66 2.59,45.82 4.06,47.3 8.08,47.3 9.25,48.46 J6.2
  Bottom 0.152: U$13.20 94.47,17.9 94.15,17.9 93.88,18.17 v93.88,20.32 | v93.78,26.08 93.19,26.67 89.92,26.67 69.8,6.55 19.66,6.55 7.32,18.9 7.32,26.73 7.34,26.75 7.34,27.56 v7.52,27.74
SCL  (via drill 0.3)
  Top 0.152: J3.2 114.8,50.28 116.07,51.55 116.07,53.69 115.31,54.45 v115.21,54.45 112.26,54.45 8.83,54.45 7.97,53.59 7.97,52.16 6.7,50.89 J5.2
  Bottom 0.152: U$13.32 98.84,21.62 100.17,22.95 119.27,22.95 119.59,23.27 119.59,49.46 119.36,52.03 118.65,53.56 117.76,54.45 v115.21,54.45
SD_MODE
  Bottom 0.305: U5.4 63.53,44.49 R2.1
SDA
  Bottom 0.152: U$13.31 98.34,21.63 99.97,23.26 118.86,23.26 119.12,23.51 119.12,50.34 117.95,51.5 113.58,51.5 | 113.58,51.5 J3.1 | J5.1 7.61,53.79 109.01,53.79 111.35,51.45 113.53,51.45 113.58,51.5
SWCLK
  Bottom 0.152: U$13.45 102.9,15.75 103.27,15.38 103.32,15.33 109.47,15.33 110.33,14.47 110.33,12.08 110.08,11.83 109.36,11.83 109.21,11.68 109.21,10.25 109.42,10.05 110.74,10.05 TP1.P$1 114.29,7.66
SWDIO  (via drill 0.3)
  Top 0.152: v111.91,5.88 109.82,5.88 102.61,13.1 v102.61,14.78
  Bottom 0.152: TP2.P$1 112.67,5.12 v111.91,5.88 | v102.61,14.78 102.13,15.25 U$13.46
VBAT
  Bottom 0.152: S1.3 74.95,4.59 79.48,9.12 X2.1
  Bottom 0.406: D2.A 104.91,7.5 104.82,7.59 102.61,9.8 94.28,9.8 93.56,9.08 C11.1
  Bottom 0.61: 90.75,9.12 X2.1 92.85,9.12 C11.1 93.56,8.12 92.91,7.47 92.91,5.03 93.3,4.64 U4.3
VBUS  (via drill 0.3)
  Top 0.305: v114.14,17.82 114.14,12.08 v109.87,7.82 109.87,7.46 v110.18,7.16
  Bottom 0.305: U1.1 108.56,4.32 108.75,4.51 108.75,7.58 R7.1 109.86,7.8 v109.87,7.82 109.87,7.46 v110.18,7.16 | J1.VBUS 115.21,16.76 114.44,16.76 v114.14,17.06 v114.14,17.82
  Bottom 0.406: U4.4 96.52,4.8 C1.1 96.57,7.45 96.66,7.46 98.14,8.93 102.41,8.93 103.22,8.12 103.22,5.28 102.9,4.96 CHG1.A 101.83,4.19 102.23,3.8 D2.C 106.11,4.32 U1.1
VDDCORE1
  Bottom 0.152: U$13.43 103.07,16.75 103.54,16.28 103.54,16.27 C10.1
VO+
  Bottom 0.305: FB3.2 C15.1 59.79,51.29 59.06,52.02 57.35,52.02 56.59,51.26 56.59,46.89 56.03,46.33 52.84,46.33 X1.2
VO-
  Bottom 0.305: C14.1 FB4.2 68.56,51.74 67.46,52.83 56.54,52.83 55.68,51.97 55.68,48.87 55.2,48.4 X1.1
(copper drawn outside any net)
  shapes: Top area x4409

### Text on the board
bPlace: Use JST or solder bare wire | SAO 1.69 | SAO 1.69 | Speaker | Speaker Output | G CI DI 3V | APA102/WS2812 | Yes yes, 3V is fine for a few pixels | Battery | LIPO BATTERY | JLCJLCJLCJLC | ON | OFF
bNames: GND | SWCLK | SWDIO | 3v3